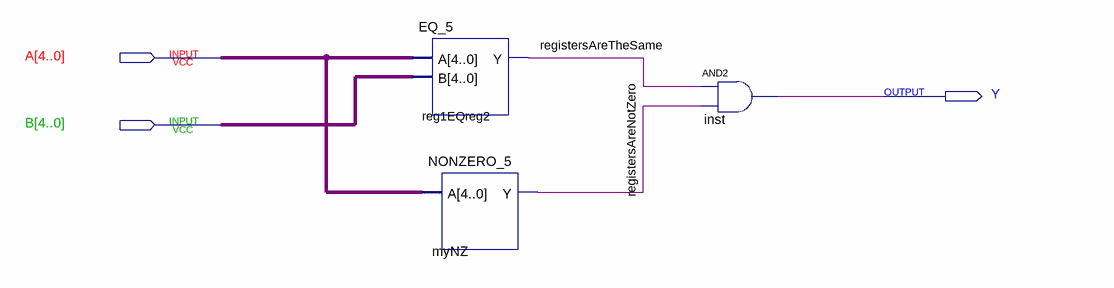
[diagram p0: schematic sheet]
// Quartus schematic EQ_NONZERO_5.bdf as structural Verilog: 3 symbols, 3 pins
module EQ_NONZERO_5 (
  input  [4:0] A,
  input  [4:0] B,
  output Y
);

  wire registersAreNotZero, registersAreTheSame;

  EQ_5 reg1EQreg2 (.A(A), .B(B), .Y(registersAreTheSame));
  NONZERO_5 myNZ (.A(A), .Y(registersAreNotZero));
  and inst (Y, registersAreTheSame, registersAreNotZero);
endmodule
